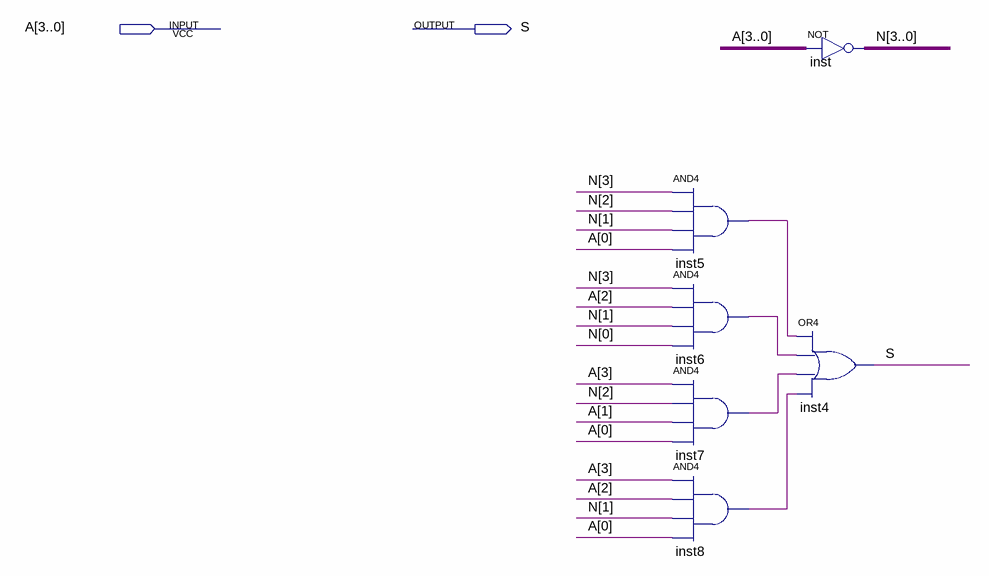
[diagram p0: schematic sheet]
// Quartus schematic displayA.bdf as structural Verilog: 6 symbols, 2 pins
module displayA (
  input  [3:0] A,
  output S
);

  wire inst5_out, inst6_out, inst7_out, inst8_out;
  wire [3:0] N;

  and inst5 (inst5_out, N[3], N[2], N[1], A[0]);
  and inst6 (inst6_out, N[3], A[2], N[1], N[0]);
  and inst7 (inst7_out, A[3], N[2], A[1], A[0]);
  and inst8 (inst8_out, A[3], A[2], N[1], A[0]);
  assign N = ~A;  // NOT inst, 4 bits wide
  or inst4 (S, inst5_out, inst6_out, inst7_out, inst8_out);
endmodule
